# EasyEDA Pro project ProProject_Quantum Mega_v0.2_2024-08-26.epro, board TopPCB
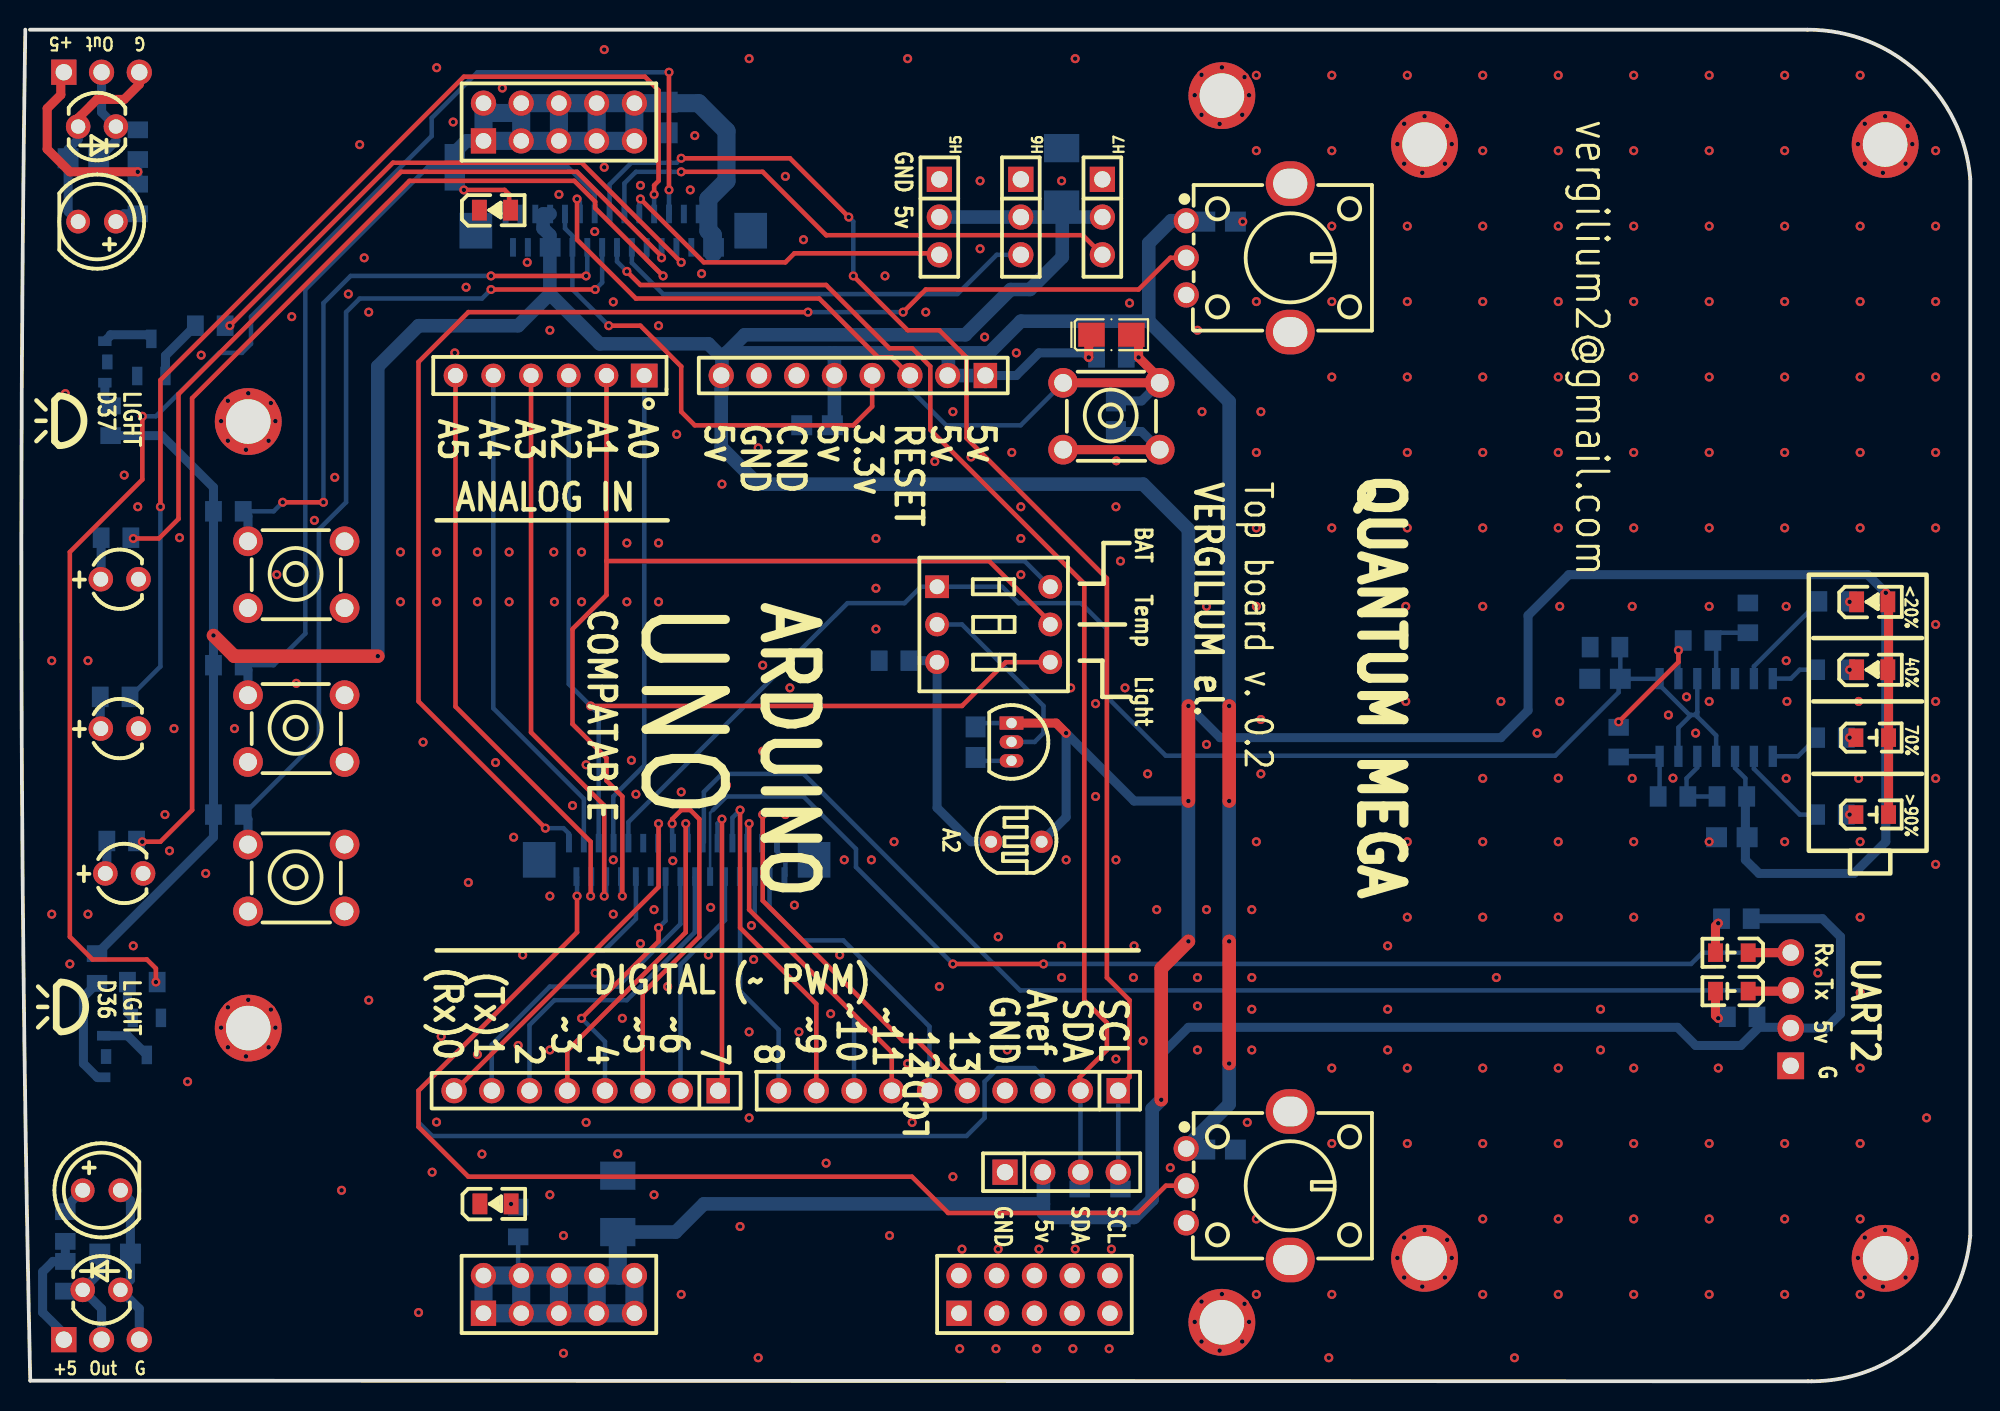
[diagram p5: board, top side]
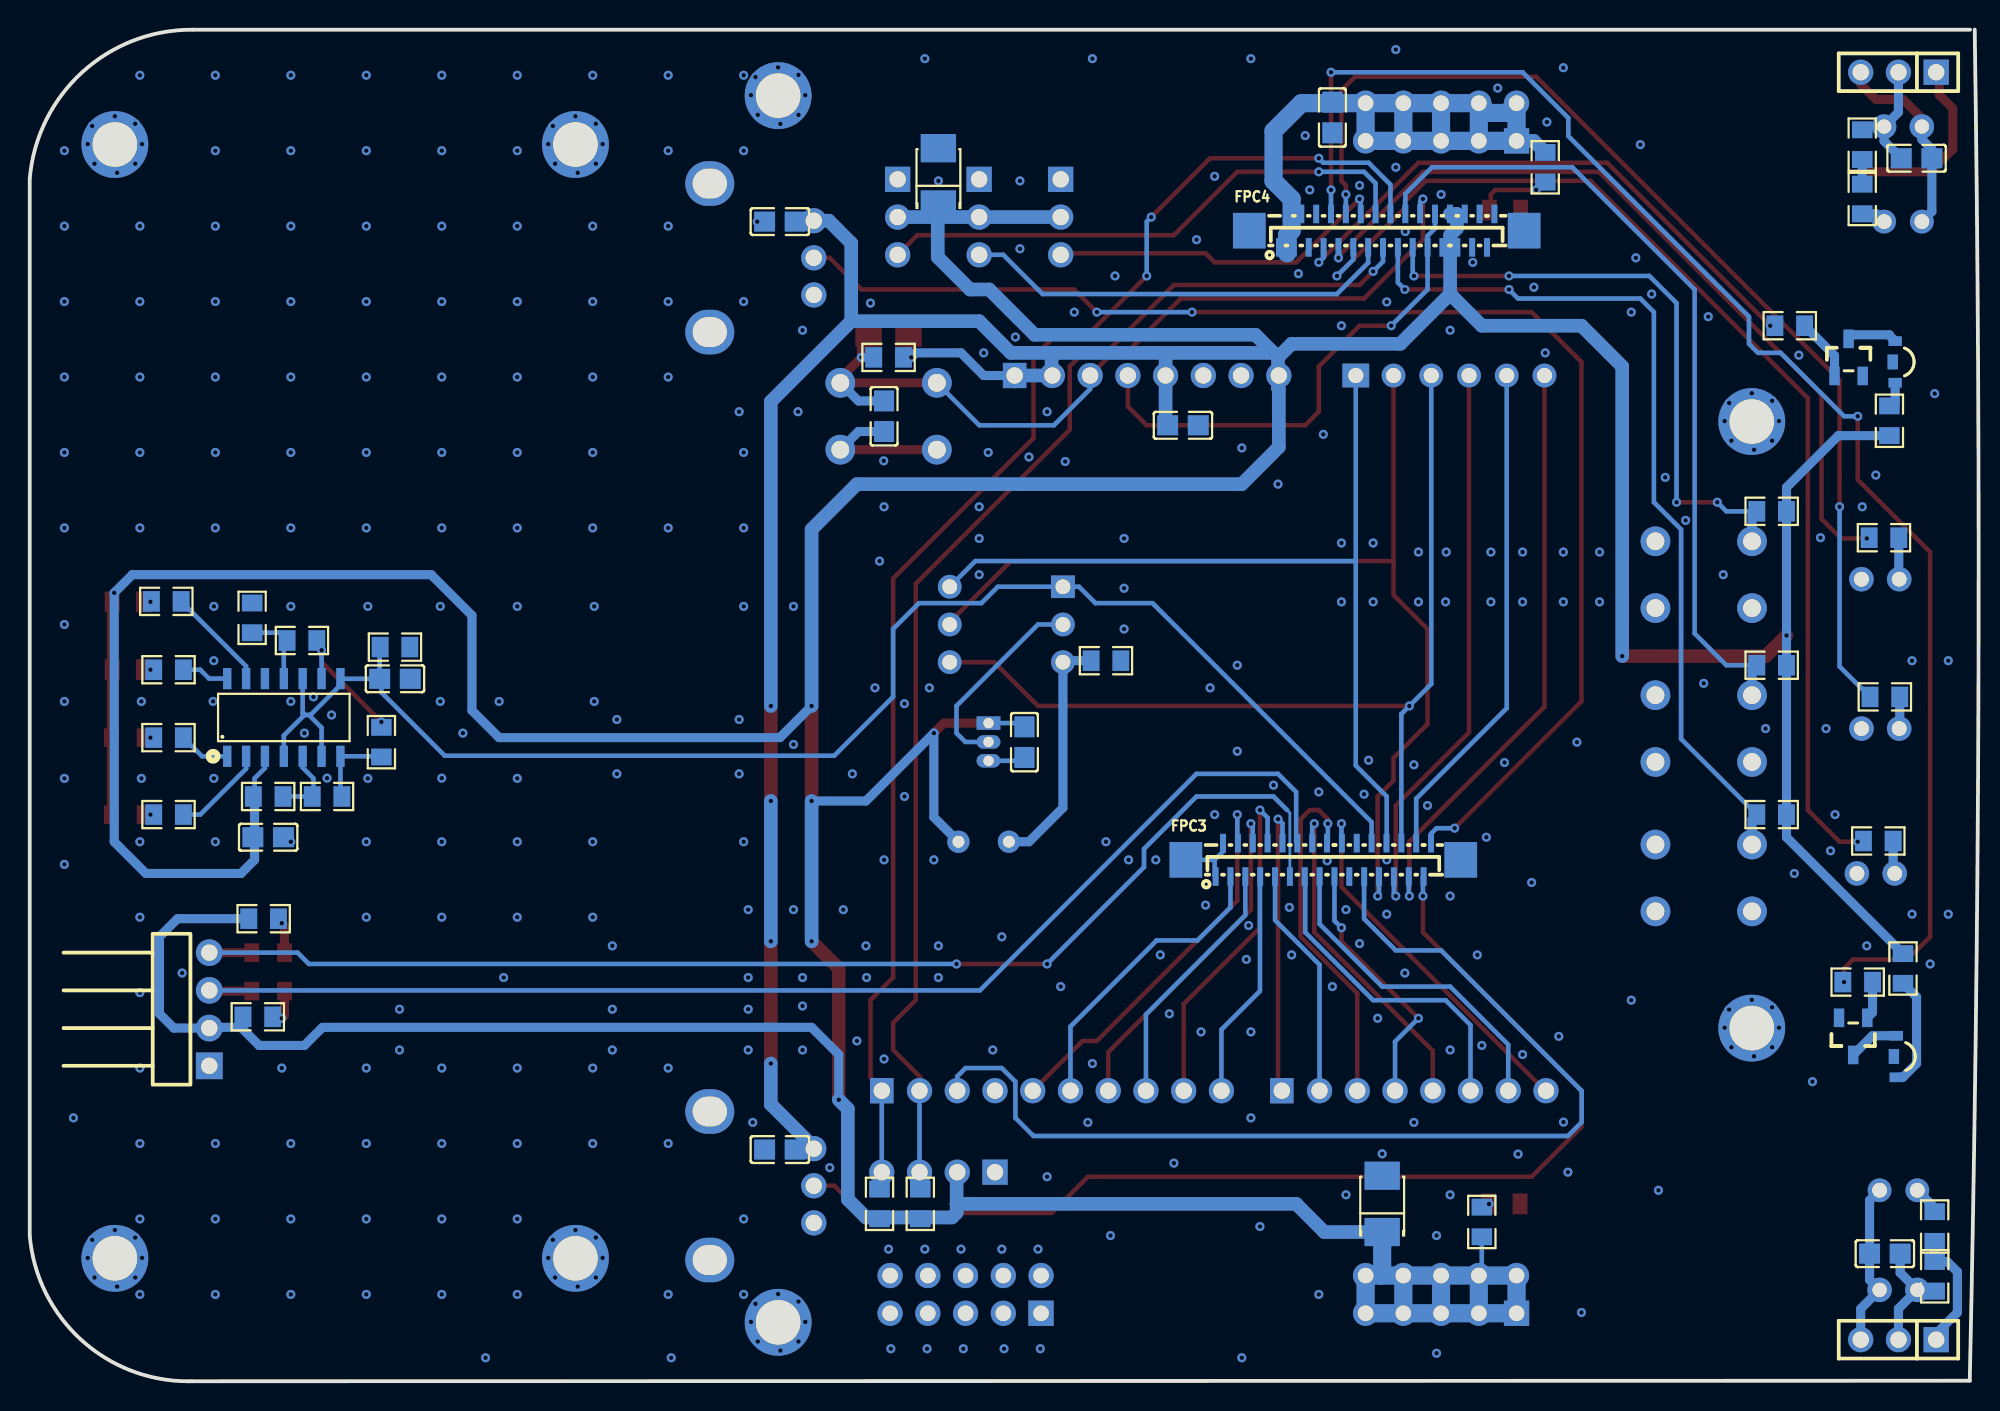
[diagram p6: board, bottom side, seen from below]

Outline 130.61 x 91.01 mm; copper layers: Top Layer, Bottom Layer. Coordinates in mm from the lower left corner of the outline.
Outline path: 0.02,91.01 119.66,91.01 arc(127.1,88.13) 130.61,80.97 130.61,9.8 arc(127.18,2.82) 119.93,0 arc(119.81,0) 119.7,0 0.04,0.04 arc(0,45.53) 0.02,91.01
Stack: Top Layer 0.035mm / Dielectric1 1.51mm FR4 er 4.5 / Bottom Layer 0.035mm

## Design rules (mm)
template: JLCPCB Capability(Single Layer Board)
spacing copperThickness1oz (default): track to track 0.102, other pairs 0.152 to 0.3
spacing copperThickness2oz: track to track 0.203, other pairs 0.152 to 0.3
track width copperThickness1oz (default): min 0.102, default 0.254, max 2.54
track width copperThickness2oz: min 0.203, default 0.254, max 2.54
differential pair differentialPair (default): width min 0.127, default 0.254, max 2.54; gap min 0.152, default 0.152
via viaSize (default): diameter min 0.5, default 1, max 10; hole min 0.3, default 0.5, max 6.3

## Placement (name value [footprint] x y rotation side)
C36  0.1u  [C0805]  52.99 64.37 0 bottom
C37  0.1u  [C0805]  42.94 85.1 90 bottom
C38  10uF  [CAP-SMD_L3.5-W2.8-R-RD]  39.58 11.95 270 bottom
C39  22p  [C0805]  73.11 64.98 270 bottom
C40  0.1u  [C0805]  106.03 47.3 0 bottom
C41  0.1u  [C0805]  63.66 43.04 90 bottom
C42  0.1u  [C0805]  80.12 15.61 180 bottom
C43  0.1u  [C0805]  80.12 78.09 180 bottom
C44  10uF  [CAP-SMD_L3.5-W2.8-R-RD]  69.45 81.14 270 bottom
C45  0.1u  [C0805]  5.75 8.59 0 bottom
C46  0.1u  [C0805]  3.62 82.36 180 bottom
C47  0.1u  [C0805]  114.56 36.64 0 bottom
D6  CD1206  [D1206-RD]  72.81 70.47 0 top
D7  SFH4545  [LED-TH_BD5.0-P2.54-FD]  4.84 12.86 0 top
D8  SFH4545  [LED-TH_BD5.0-P2.54-FD]  4.53 78.09 180 top
FPC3  FFC05012-30SSA124W5M  [FPC-SMD_FFC05012-30SSA124W5M]  43.55 35.11 180 bottom
FPC4  FFC05012-30SSA124W5M  [FPC-SMD_FFC05012-30SSA124W5M]  39.28 77.48 180 bottom
H4  UART2  [HDR-TH_4P-P2.54-H-M-W10.3]  118.53 25.05 90 bottom
H5  D32  [HDR-TH_3P-P2.54-V-M]  61.22 78.39 270 top
H6  D31  [HDR-TH_3P-P2.54-V-M]  66.71 78.39 270 top
H7  D30  [HDR-TH_3P-P2.54-V-M]  72.2 78.39 270 top
KEY1  RESET  [KEY-TH_4P-L6.0-W6.0-P4.50-LS7.5]  72.81 64.98 0 top
KEY2  D41  [KEY-TH_4P-L6.0-W6.0-P4.50-LS7.5]  17.94 54.31 0 top
KEY3  D40  [KEY-TH_4P-L6.0-W6.0-P4.50-LS7.5]  17.94 43.95 0 top
KEY4  D39  [KEY-TH_4P-L6.0-W6.0-P4.50-LS7.5]  17.94 33.89 0 top
LCD1  LCD1602+I2C  [HDR-TH_4P-P2.54-V-F]  69.45 14.08 0 top
LDR1  -  [PHOTO_RESISTOR]  66.41 36.33 270 top
LED10  D35  [LED-TH_BD4.0-P2.54-FD_RED]  6.06 54.01 0 top
LED11  D34  [LED-TH_BD4.0-P2.54-FD_RED]  6.06 43.95 0 top
LED12  D33  [LED-TH_BD4.0-P2.54-FD_RED]  6.36 34.2 0 top
LED13  LED-1204-WHITE  [LED-SMD_3P-L3.20-W1.50-WHITE-SIDE-R-RD]  5.06 21.87 270 bottom
LED14  LED-1204-WHITE  [LED-SMD_3P-L3.20-W1.50-WHITE-SIDE-R-RD]  5.14 68.64 270 bottom
LED15  Green  [LED0805-RD_RED]  124.01 38.16 0 top
LED16  Green  [LED0805-RD_YELLOW]  124.01 43.34 0 top
LED17  Yellow  [LED0805-R-RD_GREEN]  124.01 47.91 0 top
LED18  Red  [LED0805-R-RD_GREEN]  124.01 52.49 0 top
LED19  12v  [LED0805-R-RD_GREEN]  31.32 78.86 0 top
LED20  5v  [LED0805-R-RD_GREEN]  31.35 11.95 0 top
LED21  Rx  [LED0805-RD_RED]  114.56 28.86 180 top
LED22  Tx  [LED0805-RD_RED]  114.56 26.27 180 top
NOREF  -  [Pad_e130]  93.88 8.28 0 top
NOREF#2  -  [Pad_e106]  93.88 83.28 0 top
NOREF#3  -  [Pad_e64]  80.24 86.57 0 top
NOREF#4  -  [Pad_e67]  14.71 64.63 0 top
NOREF#5  -  [Pad_e166]  124.88 8.28 0 top
NOREF#6  -  [Pad_e187]  124.88 83.28 0 top
NOREF#7  -  [Pad_e66]  14.71 23.78 0 top
NOREF#8  -  [Pad_e65]  80.24 3.97 0 top
Q6  BC817  [SOT-23(SOT-23-3)]  7.88 23.23 0 bottom
Q7  BC817  [SOT-23(SOT-23-3)]  8.19 68.95 180 bottom
Q8  TEFT4300  [SENSOR-TH_TEFT4300]  4.84 6.16 90 top
Q9  TEFT4300  [SENSOR-TH_TEFT4300]  4.53 84.49 270 top
R37  10k  [R0805]  70.67 11.95 90 bottom
R38  10k  [R0805]  73.42 11.95 90 bottom
R39  1k  [R0805]  5.81 56.8 180 bottom
R40  470  [R0805]  5.75 46.09 180 bottom
R41  470  [R0805]  6.19 36.38 180 bottom
R42  10k  [R0805]  72.81 68.95 0 bottom
R43  10k  [R0805]  13.37 58.58 0 bottom
R44  10k  [R0805]  13.37 48.22 0 bottom
R45  10k  [R0805]  13.37 38.16 0 bottom
R46  A6  [RES-TH_RK09K1130AAU]  81.34 75.65 270 top
R47  A7  [RES-TH_RK09K1130AAU]  81.34 13.17 270 top
R48  1k  [R0805]  7.58 26.88 180 bottom
R49  220  [R0805]  4.53 27.8 90 bottom
R50  1k  [R0805]  12.15 71.08 180 bottom
R51  220  [R0805]  5.45 64.68 270 bottom
R53  10k  [R0805]  106.03 49.44 0 bottom
R54  5.1k  [R0805]  114.56 39.38 180 bottom
R55  1k  [R0805]  110.6 39.38 0 bottom
R56  1k  [R0805]  106.94 43.04 270 bottom
R57  1k  [R0805]  112.29 49.88 180 bottom
R58  20k  [R0805]  115.64 51.41 270 bottom
R59  470  [R0805]  121.27 38.16 180 bottom
R60  470  [R0805]  121.27 43.34 180 bottom
R61  470  [R0805]  121.27 47.91 180 bottom
R62  1k  [R0805]  121.42 52.52 180 bottom
R63  1k  [R0805]  32.88 10.73 270 bottom
R64  10k  [R0805]  28.61 81.75 90 bottom
R65  1k  [R0805]  114.87 31.15 180 bottom
R66  1k  [R0805]  115.26 24.54 180 bottom
R67  100  [R0805]  2.4 10.42 90 bottom
R68  10k  [R0805]  2.4 7.07 270 bottom
R69  100  [R0805]  7.27 79.61 270 bottom
R70  10k  [R0805]  7.27 83.27 90 bottom
R72  10k  [R0805]  58.18 48.52 0 bottom
SW2  KF1001-03P-B0-GL-DFT-01B  [SW-TH_6P-L9.9-W9.0-P2.54-LS7.6_BLUE]  64.88 50.96 270 top
U13  LM339  [SOP-14_L8.7-W3.9-P1.27-LS6.0-BL]  113.51 44.7 180 bottom
U14  A1  [TO-92-3_L4.9-W3.7-P1.27-L]  66.08 43.05 270 top
XP5  PM2.54-1*8  [HDR-TH_8P-P2.54-V-F]  55.43 67.73 180 top
XP6  PM2.54-1*6  [HDR-TH_6P-P2.54-V-F]  35.01 67.73 180 top
XP7  PM2.54-1*10  [HDR-TH_10P-P2.54-V-F]  61.83 19.57 180 top
XP8  PM2.54-1*8  [HDR-TH_8P-P2.54-V-F]  37.45 19.57 180 top
XP9  +5v  [HDR-TH_10P-P2.54-V-F-R2-C5-S2.54-4]  35.62 5.85 0 top
XP10  GND  [HDR-TH_10P-P2.54-V-F-R2-C5-S2.54-4]  67.62 5.85 0 top
XP11  +12v  [HDR-TH_10P-P2.54-V-F-R2-C5-S2.54-4]  35.62 84.79 0 top
XP12  D32  [HDR-TH_3P-P2.54-V-M]  4.84 2.8 0 bottom
XP13  D32  [HDR-TH_3P-P2.54-V-M]  4.84 88.15 0 bottom

## Footprints (pads in the part's own frame, mm; a bottom-side part is the same pattern mirrored in y, then rotated)
C0805
  rect 1.41x1.35 smd: 1(-1.03,0) 2(1.03,0)
CAP-SMD_L3.5-W2.8-R-RD
  rect 1.9x2.376 smd: 1(1.899,0) 2(-1.899,0)
D1206-RD
  rect 1.785x1.62 smd: 1(-1.343,0) 2(1.343,0)
FPC-SMD_FFC05012-30SSA124W5M
  rect 0.4x1.25 smd: 1(-7.25,-1.125) 2(-6.75,1.125) 3(-6.25,-1.125) 4(-5.75,1.125) 5(-5.25,-1.125) 6(-4.75,1.125) 7(-4.25,-1.125) 8(-3.75,1.125) 9(-3.25,-1.125) 10(-2.75,1.125) 11(-2.25,-1.125) 12(-1.75,1.125) 13(-1.25,-1.125) 14(-0.75,1.125) 15(-0.25,-1.125) 16(0.25,1.125) 17(0.75,-1.125) 18(1.25,1.125) 19(1.75,-1.125) 20(2.25,1.125) 21(2.75,-1.125) 22(3.25,1.125) 23(3.75,-1.125) 24(4.25,1.125) 25(4.75,-1.125) 26(5.25,1.125) 27(5.75,-1.125) 28(6.25,1.125) 29(6.75,-1.125) 30(7.25,1.125)
  rect 2.2x2.4 smd: 31(9.25,0) 32(-9.25,0)
HDR-TH_3P-P2.54-V-M
  rect 1.7x1.7 hole 1.1: 1(-2.54,0)
  round 1.7 hole 1.1: 2(0,0) 3(2.54,0)
HDR-TH_4P-P2.54-H-M-W10.3
  rect 1.8x1.8 hole 1.1: 1(-3.81,0)
  round 1.8 hole 1.1: 2(-1.27,0) 3(1.27,0) 4(3.81,0)
HDR-TH_4P-P2.54-V-F
  rect 1.7x1.7 hole 1.1: 1(-3.81,0)
  round 1.7 hole 1.1: 2(-1.27,0) 3(1.27,0) 4(3.81,0)
HDR-TH_6P-P2.54-V-F
  rect 1.8x1.6 hole 1.02: 1(-6.35,0)
  round 1.6 hole 1.02: 2(-3.81,0) 3(-1.27,0) 4(1.27,0) 5(3.81,0) 6(6.35,0)
HDR-TH_8P-P2.54-V-F
  rect 1.575x1.7 hole 1.1: 1(-8.89,0)
  round 1.7 hole 1.1: 2(-6.35,0) 3(-3.81,0) 4(-1.27,0) 5(1.27,0) 6(3.81,0) 7(6.35,0) 8(8.89,0)
HDR-TH_10P-P2.54-V-F
  rect 1.575x1.7 hole 1.1: 1(-11.43,0)
  round 1.7 hole 1.1: 2(-8.89,0) 3(-6.35,0) 4(-3.81,0) 5(-1.27,0) 6(1.27,0) 7(3.81,0) 8(6.35,0) 9(8.89,0) 10(11.43,0)
HDR-TH_10P-P2.54-V-F-R2-C5-S2.54-4
  rect 1.7x1.7 hole 1.05: 1(-5.08,-1.27)
  round 1.7 hole 1.05: 2(-5.08,1.27) 3(-2.54,-1.27) 4(-2.54,1.27) 5(0,-1.27) 6(0,1.27) 7(2.54,-1.27) 8(2.54,1.27) 9(5.08,-1.27) 10(5.08,1.27)
KEY-TH_4P-L6.0-W6.0-P4.50-LS7.5
  round 2 hole 1.2: 1(-3.25,-2.25) 2(3.25,-2.25) 3(3.25,2.25) 4(-3.25,2.25)
LED0805-R-RD_GREEN
  rect 1x1.399 smd: 1(1.05,0) 2(-1.05,0)
LED0805-RD_RED
  rect 1x1.25 smd: 1(-1.1,0) 2(1.1,0)
LED0805-RD_YELLOW
  rect 1x1.25 smd: 1(-1.1,0) 2(1.1,0)
LED-SMD_3P-L3.20-W1.50-WHITE-SIDE-R-RD
  rect 0.65x0.9 smd: 1(1.4,0.082) 2(-1.4,0.082)
  rect 1x0.7 smd: 3(0,-0.082)
LED-TH_BD4.0-P2.54-FD_RED
  round 1.651 hole 1: 1(-1.27,0) 2(1.27,0)
LED-TH_BD5.0-P2.54-FD
  round 1.6 hole 1: 1(-1.27,0) 2(1.27,0)
Pad_e64
  round 4.5 hole 3: 101(0,0)
Pad_e65
  round 4.5 hole 3: 101(0,0)
Pad_e66
  round 4.5 hole 3: 101(0,0)
Pad_e67
  round 4.5 hole 3: 101(0,0)
Pad_e106
  round 4.5 hole 3: 101(0,0)
Pad_e130
  round 4.5 hole 3: 101(0,0)
Pad_e166
  round 4.5 hole 3: 101(0,0)
Pad_e187
  round 4.5 hole 3: 101(0,0)
PHOTO_RESISTOR
  round 1.5 hole 0.8: 1(0,1.7) 2(0,-1.7)
R0805
  rect 1.133x1.377 smd: 1(-1,0) 2(1,0)
RES-TH_RK09K1130AAU
  round 1.7 hole 1.1: 1(-2.5,-3.5) 2(0,-3.5) 3(2.5,-3.5)
  oval 3x3.3 hole 2x2.3: 4(5,3.5) 5(-5,3.5)
SENSOR-TH_TEFT4300
  round 1.651 hole 0.965: 1(0,1.27) 2(0,-1.27)
SOP-14_L8.7-W3.9-P1.27-LS6.0-BL
  rect 0.56x1.43 smd: 1(-3.81,-2.615) 2(-2.54,-2.615) 3(-1.27,-2.615) 4(0,-2.615) 5(1.27,-2.615) 6(2.54,-2.615) 7(3.81,-2.615) 8(3.81,2.615) 9(2.54,2.615) 10(1.27,2.615) 11(0,2.615) 12(-1.27,2.615) 13(-2.54,2.615) 14(-3.81,2.615)
SOT-23(SOT-23-3)
  rect 0.7x1.25 smd: 1(-0.95,-1.25) 2(0.95,-1.25) 3(0,1.25)
SW-TH_6P-L9.9-W9.0-P2.54-LS7.6_BLUE
  rect 1.524x1.6 hole 1: 1(-2.54,-3.809)
  round 1.6 hole 1: 2(0,-3.81) 3(2.54,-3.81) 4(2.54,3.81) 5(0,3.81) 6(-2.54,3.81)
TO-92-3_L4.9-W3.7-P1.27-L
  rect 0.9x1.6 hole 0.7: 1(-1.27,0)
  oval 0.9x1.6 hole 0.7: 2(0,0) 3(1.27,0)

## Nets
As in the schematic, except:
+3.3V: FPC4.21 FPC4.22 XP5.4
+12V: C37.2 FPC4.1 FPC4.2 FPC4.3 FPC4.4 R64.2 XP11.1 XP11.2 XP11.3 XP11.4 XP11.5 XP11.6 XP11.7 XP11.8 XP11.9 XP11.10
GND: C36.1 C37.1 C38.2 C39.2 C40.1 C41.1 C42.1 C43.1 C44.2 C47.1 FPC3.1 FPC3.2 FPC3.19 FPC3.20 FPC3.31 FPC3.32 FPC4.5 FPC4.6 FPC4.27 FPC4.28 FPC4.29 FPC4.30 FPC4.31 FPC4.32 H4.1 H5.1 H6.1 H7.1 KEY1.1 KEY1.2 KEY2.1 KEY2.2 KEY3.1 KEY3.2 KEY4.1 KEY4.2 LCD1.1 LED10.2 LED11.2 LED12.2 LED19.2 LED20.2 NOREF.101 NOREF#2.101 NOREF#3.101 NOREF#4.101 NOREF#5.101 NOREF#6.101 NOREF#7.101 NOREF#8.101 Q6.2 Q7.2 R46.3 R46.4 R46.5 R47.3 R47.4 R47.5 R53.1 R58.1 R72.1 U13.12 U14.3 XP5.6 XP5.7 XP7.4 XP10.1 XP10.2 XP10.3 XP10.4 XP10.5 XP10.6 XP10.7 XP10.8 XP10.9 XP10.10
AREF: FPC3.21 XP7.3

Pads without a net: KEY2 3; KEY3 3; KEY4 3; LED13 3; LED14 3

## Via types
v1: diameter 0.61, hole 0.305, Top Layer to Bottom Layer, 476 vias

## Routing (per net, layer and track width the routed paths; a pad name or vN(x,y) marks a point on that pad's centre or on a via; arc(x,y) is an arc through that point)
+3.3V: length 33.6
  Top Layer w0.305: XP5.4 56.7,65.64 55.43,64.37 44.76,64.37 43.85,65.29 43.85,68.34 41.11,71.08 v1(38.97,71.08)
  Bottom Layer w0.305: 36.03,78.6 36.03,77.63 36.53,77.13 36.53,73.52 v1(38.97,71.08)
+5V: length 620.7
  Top Layer w0.61: U14.1 69.08,44.32 v1(69.75,43.65) ; v1(71.28,68.95) 71.28,70.29 D6.1 ; LED18.1 125.11,52.44 LED16.2 LED15.2
  Top Layer w0.914: v1(77.98,29.63) 76.16,27.8 v1(76.16,18.96) ; v1(80.73,29.63) v1(80.73,21.4) ; v1(77.98,45.48) v1(77.98,39.07) ; v1(80.73,45.48) v1(80.73,39.07) ; v1(23.43,48.83) 13.76,48.83 v1(12.37,50.22)
  Bottom Layer w0.305: XP9.4 32.87,7.32 R63.2 ; U14.1 63.91,44.32 C41.2 ; R54.1 115.47,39.47 115.47,40.6 114.78,41.3 U13.3
  Bottom Layer w0.61: 64.32,67.17 64.88,67.73 66.4,67.73 67.93,69.25 70.97,69.25 v1(71.28,68.95) ; R51.2 8.88,63.68 12.37,60.19 R43.1 v1(12.37,50.22) R44.1 R45.1 12.37,36.64 R49.2 ; R65.1 120.66,31.15 121.88,29.93 121.88,24.75 120.91,23.78 H4.2 118.47,23.83 116.39,23.83 115.17,22.62 112.12,22.62 110.9,23.83 77.98,23.83 76.16,22.01 v1(76.16,18.96) ; R54.1 115.47,39.29 115.47,35.11 116.39,34.2 122.79,34.2 124.92,36.33 v1(124.92,53.09) 123.7,54.31 103.59,54.31 100.84,51.57 100.84,45.17 99.02,43.34 80.12,43.34 v1(77.98,45.48) ; LDR1.1 69.75,37.98 v1(69.75,43.65) 74.33,39.07 v1(77.98,39.07)
  Bottom Layer w0.914: 69.5,78.39 H6.2 H5.2 ; 69.5,78.39 69.5,75.7 67.32,73.52 66.02,73.52 62.98,70.47 48.11,70.47 46.89,69.25 ; 69.5,78.39 H7.2 ; 54.16,68.95 53.85,69.25 46.89,69.25 ; 54.16,68.95 54.16,69.25 61.53,69.25 61.83,68.95 ; 54.16,68.95 XP5.5 54.16,64.51 C36.2 ; v1(80.73,21.4) 80.73,18.65 77.84,15.76 R47.1 ; 64.32,67.37 63.96,67.73 XP5.2 61.83,67.78 61.83,68.95 ; 75.32,71.38 80.73,65.97 v1(80.73,45.48) ; 75.32,71.38 66.71,71.38 64.57,69.25 61.83,69.25 61.83,68.95 ; 75.32,71.38 75.32,76.64 76.83,78.15 78.45,78.15 ; v1(77.98,29.63) v1(77.98,39.07) ; LCD1.2 68.22,14.04 68.22,11.95 ; FPC4.24 34.55,78.6 34.55,77.63 35.01,77.17 35.01,73.21 ; 46.89,69.25 46.59,68.95 ; 35.01,73.21 32.87,71.08 26.17,71.08 23.43,68.34 v1(23.43,48.83) ; 35.01,73.21 38.36,69.86 45.68,69.86 46.59,68.95 ; v1(76.16,18.96) 75.55,18.35 75.55,12.25 74.33,11.03 68.54,11.03 68.22,11.34 68.22,11.95 ; 68.22,11.95 45.37,11.95 43.47,10.05 C38.1 ; 46.59,68.95 46.59,66.86 46.54,66.81 46.54,62.9 49.03,60.41 74.94,60.41 77.98,57.36 v1(77.98,45.48) ; v1(80.73,29.63) v1(80.73,39.07)
  Bottom Layer w1.219: XP9.3 XP9.1 XP9.2 XP9.4 ; XP9.3 XP9.5 ; XP9.3 XP9.4 ; 39.65,7.12 XP9.10 XP9.9 XP9.7 ; 39.65,7.12 XP9.8 ; 39.65,7.12 39.58,7.19 C38.1 ; XP9.6 XP9.5 ; XP9.6 XP9.8 ; XP9.6 XP9.4 ; XP9.5 XP9.7 ; XP9.7 XP9.8
+12V: length 51.7
  Bottom Layer w0.914: XP11.1 29.38,83.52 R64.2
  Bottom Layer w1.219: XP11.8 XP11.7 ; XP11.8 XP11.10 ; XP11.8 XP11.6 ; XP11.7 XP11.5 ; XP11.7 XP11.9 XP11.10 ; 45.98,75.95 45.98,77.17 45.68,77.48 45.68,79.61 46.89,80.83 46.89,84.19 45.02,86.06 XP11.10 ; XP11.5 XP11.3 ; XP11.5 XP11.6 ; XP11.4 32.42,85.4 31.2,85.4 XP11.2 XP11.1 XP11.3 ; XP11.4 XP11.6 ; XP11.4 XP11.3
GND: length 16.9
  Top Layer w0.61: KEY1.2 69.56,62.73
  Bottom Layer w0.305: C41.1 63.88,41.78 U14.3 ; FPC3.32 50.86,35.11 ; 50.86,35.11 50.86,34.05 FPC3.1 ; 50.86,35.11 50.29,35.68 FPC3.2
  Bottom Layer w0.61: KEY1.2 74.83,63.95 C39.2
  vias: v1(1.48,48.52) v1(1.48,31.45) v1(2.4,66.51) v1(2.7,28.1) v1(3.92,48.52) v1(3.92,31.45) v1(6.36,61.02) v1(6.97,29.32) v1(7.27,58.89) v1(9.1,38.16) v1(9.41,35.72) v1(9.71,43.95) v1(10.08,56.8) v1(10.63,20.18) v1(11.54,69.1) v1(11.85,34.2) v1(12.88,64.65) v1(12.88,23.81) v1(13.34,66.03) v1(13.34,63.33) v1(13.34,25.18) v1(13.34,22.49) v1(13.78,43.95) v1(14.56,62.72) v1(14.56,21.88) v1(14.71,66.53) v1(14.71,25.69) v1(16.08,63.33) v1(16.08,22.49) v1(16.23,65.87) v1(16.23,25.03) v1(16.54,64.65) v1(16.54,23.81) v1(16.63,54.31) v1(17.64,71.69) v1(17.94,47) v1(19.16,57.97) v1(20.53,60.87) v1(20.99,12.86) v1(21.45,73.21) v1(22.21,83.27) v1(22.51,75.65) v1(22.82,71.99) v1(22.82,25.66) v1(24.95,55.84) v1(24.95,52.49) v1(26.17,4.63) v1(26.48,43.04) v1(27.09,14.08) v1(27.39,88.45) v1(27.39,55.84) v1(27.39,52.49) v1(27.38,17.45) v1(27.7,23.23) v1(28.5,84.79) v1(28.61,69.25) v1(29.37,73.67) v1(29.52,33.59) v1(30.13,55.84) v1(30.13,52.49) v1(30.13,22.01) v1(30.44,15.3) v1(31.35,41.67) v1(31.81,87.08) v1(32.27,55.84) v1(32.27,52.49) v1(32.57,36.64) v1(32.88,22.62) v1(33.18,28.71) v1(33.49,75.35) v1(35.01,70.77) v1(35.01,32.67) v1(35.01,22.31) v1(35.01,12.56) v1(35.28,55.84) v1(35.32,52.49) v1(35.62,79.92) v1(35.93,9.81) v1(35.93,1.89) v1(36.54,38.77) v1(37.14,55.84) v1(37.14,52.49) v1(37.45,41.51) v1(37.45,17.43) v1(38.03,77.42) v1(38.06,27.49) v1(38.67,89.67) v1(38.67,81.75) v1(39.28,72.68) v1(39.28,35.11) v1(39.28,31.45) v1(39.58,15.32) v1(39.89,24.44) v1(40.19,56.45) v1(40.19,52.49) v1(40.5,41.82) v1(40.8,39.53) v1(41.11,80.53) v1(41.11,29.47) v1(42.02,31.76) v1(42.02,12.56) v1(42.33,71.08) v1(42.33,56.45) v1(42.33,52.49) v1(42.94,26.58) v1(43.29,35.05) v1(43.55,63.76) v1(43.85,39.68) v1(43.85,5.85) v1(44.46,80.22) v1(44.76,83.88) v1(45.22,74.58) v1(45.68,28.71) v1(45.83,31.91) v1(46.59,60.41) v1(46.9,40.14) v1(47.81,10.42) v1(48.42,89.06) v1(48.42,23.53) v1(48.42,17.74) v1(48.57,30.69) v1(48.73,28.41) v1(49.03,62.85) v1(49.03,1.58) v1(49.34,48.22) v1(49.34,42.43) v1(50.86,81.14) v1(50.86,38.16) v1(51.17,46.69) v1(51.47,32.06) v1(51.78,23.53) v1(52.08,76.87) v1(53.6,14.69) v1(53.91,24.75) v1(54.52,28.71) v1(54.82,35.11) v1(56.65,35.11) v1(56.96,56.75) v1(56.96,53.4) v1(56.96,50.66) v1(57.57,74.43) v1(57.87,9.81) v1(58.18,36.33) v1(59.09,89.06) v1(59.09,21.4) v1(59.4,17.43) v1(60.31,71.99) v1(60.92,61.93) v1(61.22,26.58) v1(62.14,65.29) v1(62.14,13.78) v1(62.6,2.19) v1(62.75,8.9) v1(63.36,62.24) v1(63.97,80.83) v1(63.97,76.26) v1(64.27,70.32) v1(65.03,2.19) v1(65.19,29.93) v1(65.19,8.9) v1(65.8,22.31) v1(66.1,62.54) v1(66.41,69.25) v1(66.71,58.89) v1(66.71,56.75) v1(66.71,54.31) v1(67.78,2.19) v1(67.93,8.9) v1(69.45,80.83) v1(69.45,29.32) v1(69.45,27.19) v1(69.76,35.11) v1(70.06,46.69) v1(70.22,2.19) v1(70.37,89.06) v1(70.37,8.9) v1(71.74,45.63) v1(71.74,39.38) v1(72.65,2.19) v1(72.81,8.9) v1(73.13,61.98) v1(73.11,58.89) v1(73.11,35.11) v1(73.11,21.7) v1(73.42,55.23) v1(73.72,46.69) v1(74.03,72.6) v1(74.29,27.19) v1(74.33,29.32) v1(74.94,22.92) v1(75.24,40.9) v1(75.85,31.76) v1(76.77,14.39) v1(78.41,86.6) v1(78.41,4) v1(78.6,70.77) v1(78.6,27.19) v1(78.6,25.27) v1(78.6,22.31) v1(78.87,87.97) v1(78.87,85.28) v1(78.9,65.29) v1(78.87,5.37) v1(78.87,2.68) v1(79.21,52.18) v1(79.21,42.88) v1(79.21,31.76) v1(80.09,84.67) v1(80.09,2.07) v1(80.24,88.48) v1(80.24,5.87) v1(81.61,85.28) v1(81.65,78.09) v1(81.61,2.68) v1(81.76,87.82) v1(81.76,5.22) v1(81.95,17.43) v1(82.07,86.6) v1(82.07,4) v1(82.26,31.76) v1(82.26,27.19) v1(82.26,25.05) v1(82.26,22.31) v1(82.56,87.94) v1(82.56,82.86) v1(82.56,72.7) v1(82.56,62.54) v1(82.56,57.46) v1(82.56,52.18) v1(82.56,36.33) v1(82.56,10.93) v1(82.56,5.85) v1(82.86,65.29) v1(82.86,44.56) v1(82.86,40.9) v1(87.44,1.58) v1(87.64,87.94) v1(87.64,82.86) v1(87.64,77.78) v1(87.64,72.7) v1(87.64,67.62) v1(87.64,57.46) v1(87.64,21.09) v1(87.64,16.01) v1(87.64,5.85) v1(91.09,44.56) v1(91.09,40.9) v1(91.4,29.32) v1(91.4,25.05) v1(91.4,22.31) v1(92.05,83.31) v1(92.05,8.31) v1(92.51,84.68) v1(92.51,81.99) v1(92.51,9.68) v1(92.51,6.99) v1(92.62,52.18) v1(92.62,45.78) v1(92.72,87.94) v1(92.72,77.78) v1(92.72,72.7) v1(92.72,67.62) v1(92.72,62.54) v1(92.72,57.46) v1(92.72,36.33) v1(92.72,31.25) v1(92.72,21.09) v1(92.72,16.01) v1(93.73,81.38) v1(93.73,6.38) v1(93.88,85.18) v1(93.88,10.18) v1(95.25,81.99) v1(95.25,6.99) v1(95.41,84.53) v1(95.41,9.53) v1(95.71,83.31) v1(95.71,8.31) v1(97.8,87.94) v1(97.8,82.86) v1(97.8,77.78) v1(97.8,72.7) v1(97.8,67.62) v1(97.8,62.54) v1(97.8,57.46) v1(97.8,52.18) v1(97.8,40.6) v1(97.8,36.33) v1(97.8,31.25) v1(97.8,21.09) v1(97.8,16.01) v1(97.8,10.93) v1(97.8,5.85) v1(98.71,27.19) v1(99.02,45.78) v1(99.93,1.58) v1(101.46,43.65) v1(102.88,87.94) v1(102.88,82.86) v1(102.88,77.78) v1(102.88,72.7) v1(102.88,67.62) v1(102.88,62.54) v1(102.88,57.46) v1(102.88,40.61) v1(102.88,36.33) v1(102.88,31.25) v1(102.88,21.09) v1(102.88,16.01) v1(102.88,10.93) v1(102.88,5.85) v1(102.98,52.18) v1(102.98,45.78) v1(105.72,25.05) v1(105.72,22.31) v1(107.86,52.18) v1(107.86,40.6) v1(107.96,87.94) v1(107.96,82.86) v1(107.96,77.78) v1(107.96,72.7) v1(107.96,67.62) v1(107.96,62.54) v1(107.96,57.46) v1(107.96,36.33) v1(107.96,31.25) v1(107.96,21.09) v1(107.96,16.01) v1(107.96,10.93) v1(107.96,5.85) v1(110.3,44.87) v1(110.6,40.61) v1(111.52,46.09) v1(112.13,43.65) v1(113.04,87.94) v1(113.04,82.86) v1(113.04,77.78) v1(113.04,72.7) v1(113.04,67.62) v1(113.04,62.54) v1(113.04,57.46) v1(113.04,52.18) v1(113.04,45.78) v1(113.04,36.33) v1(113.04,16.01) v1(113.04,10.93) v1(113.04,5.85) v1(113.65,21.09) v1(118.12,87.94) v1(118.12,82.86) v1(118.12,77.78) v1(118.12,72.7) v1(118.12,67.62) v1(118.12,62.54) v1(118.12,57.46) v1(118.12,36.33) v1(118.12,16.01) v1(118.12,10.93) v1(118.12,5.85) v1(118.22,52.18) v1(118.22,48.52) v1(118.27,45.78) v1(118.22,40.6) v1(120.36,27.49) v1(123.05,83.31) v1(123.1,45.78) v1(123.1,40.6) v1(123.05,8.31) v1(123.2,87.94) v1(123.2,77.78) v1(123.2,72.7) v1(123.2,67.62) v1(123.2,62.54) v1(123.2,57.46) v1(123.2,36.33) v1(123.2,31.25) v1(123.2,26.17) v1(123.2,21.09) v1(123.2,16.01) v1(123.2,10.93) v1(123.2,5.85) v1(123.51,84.68) v1(123.51,81.99) v1(123.51,9.68) v1(123.51,6.99) v1(124.73,81.38) v1(124.73,6.38) v1(124.88,85.18) v1(124.88,10.18) v1(126.25,81.99) v1(126.25,6.99) v1(126.41,84.53) v1(126.41,9.53) v1(126.71,83.31) v1(126.71,8.31) v1(127.67,17.74) v1(128.28,82.86) v1(128.28,77.78) v1(128.28,72.7) v1(128.28,67.62) v1(128.28,62.54) v1(128.28,57.46) v1(128.28,50.96) v1(128.28,45.78) v1(128.28,40.6) v1(128.28,34.81)
+BAT: length 102.3
  Bottom Layer w0.305: C40.2 106.94,47.19 106.94,46.39 102.67,42.12 76.46,42.12 72.5,46.09 72.5,50.66 70.76,52.4 66.56,52.4 65.45,53.5 SW2.1 59.98,53.5 58.88,52.4 55.04,52.4 40.29,37.65 FPC3.22 ; C40.2 109.68,47.3 U13.8 109.7,46.88 111.72,44.87 111.82,44.87 ; C40.2 107.06,49.41 R53.2 ; U13.10 112.24,45.06 ; 112.24,45.06 112.24,44.75 113.51,43.48 U13.4 ; 112.24,45.06 112.05,44.87 111.82,44.87 ; 111.82,44.87 110.97,44.01 U13.6
A0: length 60.4
  Bottom Layer w0.305: FPC3.24 39.27,36.25 39.27,39.38 41.36,41.46 41.36,55.23 ; SW2.6 66.96,55.23 41.36,55.23 ; XP6.1 41.36,55.23
A1: length 70.5
  Top Layer w0.305: 38.82,55.23 64.57,55.23 68.69,51.11 SW2.5 ; 38.82,55.23 38.82,52.94 36.53,50.66 36.53,44.26 38.82,41.97 38.82,40.45 39.88,39.38 v1(39.88,32.67) ; 38.82,55.23 XP6.2
  Bottom Layer w0.305: FPC3.23 39.8,32.77 v1(39.89,32.67)
A2: length 64.5
  Top Layer w0.305: SW2.4 65.69,48.42 62.75,45.48 v1(37.75,45.48)
  Bottom Layer w0.305: FPC3.26 38.3,44.93 v1(37.75,45.48) 36.28,46.95 XP6.3
A3: length 38.5
  Top Layer w0.305: v1(38.67,32.67) 38.67,38.77 33.74,43.7 XP6.4
  Bottom Layer w0.305: FPC3.25 38.8,32.8 v1(38.67,32.67)
A4: length 34
  Bottom Layer w0.305: XP6.5 31.2,45.32 37.3,39.23 FPC3.28
A5: length 40.1
  Top Layer w0.305: XP6.6 28.66,45.42 37.75,36.33 v1(37.75,32.67)
  Bottom Layer w0.305: v1(37.75,32.67) 37.79,32.72 FPC3.27
AREF: length 71.3
  Bottom Layer w0.305: FPC3.21 40.8,33.98 40.8,31.15 38.67,29.02 35.62,29.02 26.15,19.55 26.15,17.45 27.09,16.52 63.05,16.52 64.27,17.74 64.27,20.18 65.19,21.09 67.62,21.09 68.18,20.53 XP7.3
BTN0: length 41.6
  Top Layer w0.305: v1(31.05,74.43) v1(37.45,74.43) ; v1(19.77,59.19) v1(17.02,59.19)
  Bottom Layer w0.305: v1(31.05,74.43) 21.6,74.43 19.77,72.6 v1(19.77,59.19) ; FPC4.19 37.53,74.51 v1(37.45,74.43) ; R43.2 16.41,58.58 v1(17.02,59.19)
  Bottom Layer w0.61: 14.69,56.56 14.69,58.26 R43.2
BTN1: length 55.4
  Bottom Layer w0.305: FPC4.18 38.03,79.95 36.23,81.75 26.78,81.75 18.55,73.52 18.55,50.35 16.42,48.22 R44.2
  Bottom Layer w0.61: 14.69,46.2 14.69,47.9 R44.2
BTN2: length 59.3
  Top Layer w0.305: v1(31.05,73.52) v1(38.06,73.52)
  Bottom Layer w0.305: 38.53,76.35 38.53,73.99 v1(38.06,73.52) ; v1(31.05,73.52) 30.44,72.91 22.21,72.91 21.29,71.99 21.29,59.19 19.46,57.36 19.46,43.26 R45.2
  Bottom Layer w0.61: 14.69,36.14 14.69,37.84 R45.2
D0: length 25.1
  Top Layer w0.305: 28.56,19.52 42.33,33.28 v1(42.33,37.55)
  Bottom Layer w0.305: FPC3.18 42.32,36.27 v1(42.32,37.55)
D1: length 22.4
  Bottom Layer w0.305: XP8.7 31.1,22.67 35.01,26.58 39.58,26.58 43.8,30.79 FPC3.15
D2: length 21.9
  Bottom Layer w0.305: FPC3.13 44.76,33.96 44.76,30.24 40.19,25.66 35.32,25.66 33.64,23.99 XP8.6
D3: length 22.7
  Top Layer w0.305: XP8.5 36.18,22.26 44.15,30.23 v1(44.15,37.55)
  Bottom Layer w0.305: v1(44.16,37.55) 44.3,37.41 FPC3.14
D4: length 17.4
  Top Layer w0.305: v1(42.32,30.54) 42.32,29.63 v1(37.14,24.44)
  Bottom Layer w0.305: v1(37.14,24.44) 38.72,22.87 XP8.4 ; FPC3.17 42.79,31.01 v1(42.32,30.54)
D5: length 23.8
  Top Layer w0.305: XP8.3 41.26,26.12 45.07,29.93 45.07,37.86 44.46,38.47 43.85,38.47 43.24,37.86 v1(43.24,37.55)
  Bottom Layer w0.305: FPC3.16 43.24,36.29 v1(43.24,37.55)
D6: length 15.7
  Bottom Layer w0.305: XP8.2 43.8,28.05 46.79,31.05 FPC3.9
D7: length 20.1
  Top Layer w0.305: XP8.1 46.59,19.82 v1(46.59,37.86)
  Bottom Layer w0.305: v1(46.59,37.86) 46.3,37.56 FPC3.10
D8: length 15.5
  Bottom Layer w0.305: XP7.10 50.4,23.68 47.81,26.27 47.81,33.97 FPC3.7
D9: length 23.5
  Top Layer w0.305: v1(47.81,38.47) 47.81,30.54 52.94,25.41 XP7.9
  Bottom Layer w0.305: v1(47.81,38.47) 47.3,37.95 FPC3.8
D10: length 17.2
  Bottom Layer w0.305: XP7.8 55.48,24.7 48.79,31.39 FPC3.5
D11: length 23.3
  Top Layer w0.305: XP7.7 58.02,22.16 48.42,31.76 v1(48.42,37.55)
  Bottom Layer w0.305: v1(48.42,37.55) 48.3,37.42 FPC3.6
D12: length 20.5
  Bottom Layer w0.305: FPC3.3 49.8,31.91 52.02,29.69 54.76,29.69 60.56,23.89 XP7.6
D13: length 26.8
  Top Layer w0.305: XP7.5 59.75,22.92 58.78,22.92 49.33,32.37 v1(49.33,38.16)
  Bottom Layer w0.305: v1(49.34,38.16) 49.34,36.28 FPC3.4
D30: length 36.9
  Top Layer w0.305: H7.3 70.88,77.17 53.6,77.17 49.34,81.44 v1(43.85,81.44)
  Bottom Layer w0.305: v1(43.85,81.44) 40.8,81.44 40.02,80.67 FPC4.14
D31: length 29.2
  Bottom Layer w0.305: 40.53,76.35 40.53,75.31 42.63,73.21 62.44,73.21 65.08,75.85 H6.3
D32: length 23.2
  Top Layer w0.305: H5.3 61.12,75.96 51.47,75.96 50.86,75.35 45.37,75.35 v1(41.11,79.61)
  Bottom Layer w0.305: v1(41.11,79.61) 41.03,79.53 FPC4.12
D33: length 75
  Top Layer w0.305: v1(42.63,74.43) 38.06,79 38.06,79.43 36.66,80.83 25.56,80.83 10.93,66.2 10.93,38.47 8.79,36.33 v1(7.58,36.33)
  Bottom Layer w0.305: v1(42.63,74.43) 41.53,75.53 41.53,76.35
D34: length 73
  Top Layer w0.305: v1(42.02,79.92) 42.02,80.53 42.32,80.83 42.32,86.93 41.41,87.84 29.22,87.84 8.79,67.42 v1(8.79,58.89)
  Bottom Layer w0.305: v1(8.79,58.89) 8.79,48.13 R40.1 ; FPC4.10 v1(42.02,79.92)
D35: length 53.9
  Top Layer w0.305: v1(42.53,75.65) 42.53,75.75 36.84,81.44 24.99,81.44 10.02,66.47 10.02,58.07 8.7,56.75 v1(6.97,56.75)
  Bottom Layer w0.305: 42.53,76.35 v1(42.53,75.65)
D36: length 101
  Top Layer w0.305: v1(43.02,80.22) v1(43.02,88.15) ; v1(8.49,26.88) 8.49,27.8 7.88,28.41 4.22,28.41 2.7,29.93 2.7,55.84 7.58,60.72 v1(7.58,64.98)
  Bottom Layer w0.305: v1(7.58,64.98) 8.49,64.98 12.76,69.25 14.28,69.25 14.89,69.86 14.89,71.69 27.05,83.85 27.05,85.07 30.13,88.15 v1(43.02,88.15) ; FPC4.8 v1(43.02,80.22)
D37: length 38.8
  Top Layer w0.305: v1(13.47,71.08) 24.44,82.05 37.14,82.05 v1(43.85,75.35)
  Bottom Layer w0.305: v1(43.85,75.35) 43.53,75.67 43.53,76.35
POT1: length 91.9
  Top Layer w0.305: v1(34.7,37.25) 26.17,45.78 26.17,68.64 29.52,71.99 v1(52.38,71.99) ; v1(58.78,71.99) 60.31,73.52 74.63,73.52 76.77,75.65 R46.2
  Bottom Layer w0.305: v1(34.7,37.25) 35.92,37.25 36.29,36.88 FPC3.30 ; v1(58.78,71.99) v1(52.38,71.99)
POT2: length 76.1
  Top Layer w0.305: v1(36.84,32.67) 36.84,30.24 26.17,19.57 26.17,17.13 29.52,13.78 59.38,13.78 61.82,11.34 74.64,11.34 76.46,13.17 R47.2
  Bottom Layer w0.305: v1(36.84,32.67) 36.84,33.94 FPC3.29
RESET: length 58.2
  Top Layer w0.305: XP5.3 58.02,68.95 57.11,68.95 53.15,72.91 40.8,72.91 36.84,76.87 v1(36.84,79.61)
  Top Layer w0.61: 69.55,67.23 KEY1.3 76.05,67.52 v1(74.63,68.95) 74.63,69.98 D6.2
  Bottom Layer w0.305: 69.56,67.23 66.7,64.37 61.68,64.37 59.24,66.81 XP5.3 ; 37.03,78.6 37.03,79.42 v1(36.84,79.61)
  Bottom Layer w0.61: KEY1.3 74.83,66.01 C39.1 ; v1(74.63,68.95) R42.2
RX2: length 86
  Top Layer w0.305: v1(62.14,28.1) v1(68.23,28.1)
  Top Layer w0.61: LED21.1 H4.4
  Bottom Layer w0.178: 45.98,38.47 45.8,38.28 FPC3.11
  Bottom Layer w0.305: H4.4 112.58,28.86 111.82,28.1 v1(68.23,28.1) ; 45.98,38.47 46.89,39.38 52.08,39.38 55.61,35.84 55.61,34.62 v1(62.13,28.1)
SCL: length 93.1
  Top Layer w0.305: v1(55.43,74.43) 59.09,70.77 61.22,70.77 63.05,68.95 63.05,63.51 72.5,54.06 72.5,27.19 74.02,25.66 74.02,20.48 73.26,19.72 ; v1(43.85,82.36) 51.16,82.36 v1(55.12,78.39)
  Bottom Layer w0.305: v1(43.85,82.36) 43.54,82.05 40.49,82.05 39.02,80.58 FPC4.16 ; v1(55.12,78.39) 55.43,78.09 v1(55.43,74.43) ; LCD1.4 73.26,18.65
SDA: length 84
  Top Layer w0.305: v1(40.19,74.74) 41.11,73.82 53.6,73.82 57.87,69.55 59.4,69.55 60.61,68.34 60.61,64.07 70.98,53.71 70.98,25.66 72.5,24.14 72.5,22.31 70.67,20.48 70.67,19.62 XP7.2
  Bottom Layer w0.305: 39.53,76.35 39.53,75.4 v1(40.19,74.74) ; LCD1.3 70.72,18.65
TX2: length 86.1
  Top Layer w0.61: H4.3 118.47,26.27 LED22.1
  Bottom Layer w0.305: H4.3 66.66,26.32 52.08,40.9 46.59,40.9 45.37,39.68 45.37,36.32 FPC3.12
$1N2925: length 2.8
  Bottom Layer w0.61: LED10.1 4.81,54.04 R39.2
$1N2926: length 2.1
  Bottom Layer w0.61: LED11.1 4.75,43.99 R40.2
$1N2927: length 2.2
  Bottom Layer w0.61: R41.2 5.19,34.3 LED12.1
$1N3000: length 3.4
  Bottom Layer w0.61: 7.88,21.98 6.59,23.27 LED13.2
$1N3001: length 7.5
  Bottom Layer w0.61: LED13.1 4.54,20.47 3.62,21.4 3.62,25.88 R49.1
$1N3003: length 2.6
  Bottom Layer w0.61: R48.2 6.58,24.83 Q6.1
$1N3005: length 3.4
  Bottom Layer w0.61: LED14.2 5.44,70.43 5.44,70.47 7.91,70.47 Q7.3
$1N3007: length 4.2
  Bottom Layer w0.61: R50.2 9.14,69.07 Q7.1
$1N3009: length 1.8
  Bottom Layer w0.61: 5.36,65.59 5.06,65.89 LED14.1
$1N8006: length 5.5
  Bottom Layer w0.305: R56.2 106.99,42.09 U13.7 109.7,39.48 R55.1
$1N8015: length 9.2
  Top Layer w0.305: v1(110.97,49.23) 110.97,48.43 v1(106.94,44.4)
  Bottom Layer w0.305: U13.9 v1(110.97,49.23) 110.97,49.56 R57.2
$1N8024: length 5.2
  Bottom Layer w0.305: R58.2 113.81,50.41 R57.1 113.51,49.66 U13.11
$1N8311: length 6
  Bottom Layer w0.305: 119.96,38.16 119.14,38.16 116.05,41.25 U13.2
$1N8350: length 3.5
  Bottom Layer w0.305: R60.2 119.01,42.09 U13.1
$1N8389: length 3.2
  Bottom Layer w0.305: U13.14 118.53,47.32 119.13,47.91 R61.2
$1N8428: length 7
  Bottom Layer w0.305: U13.13 116.05,48.15 R62.2
$1N8588:
  vias: v1(122.49,38.16)
$1N8590:
  vias: v1(122.49,43.34)
$1N8592:
  vias: v1(122.49,47.91)
$1N8594:
  vias: v1(122.49,52.49)
$1N8734: length 5
  Bottom Layer w0.305: U13.5 112.24,41.32 111.52,40.6 111.52,39.47 R55.2 R54.2
$1N8989: length 4.3
  Top Layer w0.305: v1(29.22,80.22) 31.96,80.22 32.26,79.92 32.26,78.96 LED19.1
$1N9069:
  vias: v1(32.39,11.94)
$1N18209: length 2.1
  Top Layer w0.61: v1(113.65,30.85) 113.46,30.66 LED21.2
$1N18241: length 1.9
  Top Layer w0.61: v1(113.65,24.44) 113.46,24.63 LED22.2
$1N20700: length 8.3
  Bottom Layer w0.61: XP12.1 2.3,3.21 0.87,4.64 0.87,7.37 1.57,8.07 R68.1 R67.1
$1N20704: length 1.9
  Bottom Layer w0.61: D7.1 2.4,11.69 R67.2
$1N20961: length 14
  Top Layer w0.61: XP13.1 2.09,87.94 2.09,86.62 1.18,85.71 1.18,82.97 2.7,81.44 v1(7.27,81.44)
  Bottom Layer w0.61: R70.1 v1(7.27,81.44) R69.1
$1N20964: length 1.7
  Bottom Layer w0.61: D8.1 6.33,78.61 R69.2
$1N28690: length 13.7
  Bottom Layer w0.305: SW2.2 62.75,50.96 68.23,45.48 68.23,43.65 67.64,43.05 U14.2
$1N28836: length 16.4
  Bottom Layer w0.61: LDR1.2 63.35,36.33 61.07,38.62 61.07,48.52 R72.2
$1N31594: length 6.7
  Bottom Layer w0.61: C46.1 5.8,83.51 Q9.1 4.83,85.45 XP13.2
$1N31601: length 13.4
  Top Layer w0.61: Q9.2 3.26,85.05 4.53,86.32 6.36,86.32 7.37,87.33 7.37,88.15
  Bottom Layer w0.61: Q9.2 3.26,83.63 2.58,82.95 C46.2 2.58,78.76 D8.2
$1N31638: length 6.8
  Bottom Layer w0.61: XP12.2 4.83,4.89 Q8.1 4.72,7.31 C45.1
$1N31645: length 11.1
  Bottom Layer w0.61: D7.2 6.78,12.19 C45.2 6.78,6.83 Q8.2 7.37,4.89 7.37,2.8

## Copper pours and planes (outline as drawn; the poured copper is in the pictures)
GND on Top Layer: -9.79,99.73 149.31,99.73 149.31,-8.17 -9.79,-8.17
GND on Top Layer: -0.35,90.89 131.02,90.89 131.02,0.06 -0.35,0.06
GND on Bottom Layer: -0.35,90.89 130.11,90.89 130.11,0.06 -0.35,0.06
GND on Bottom Layer: -0.35,22.31 27.05,0.06 130.72,0.06 130.72,90.59 27.24,90.89 -0.04,68.03

## Text on the board
Top Silkscreen Layer: <20% | >90% | 40% | 70% | +5 | Out | G | LIGHT / D37 | LIGHT / D36 | GND | 5v | A2 | SDA | SCL | BAT | Temp | Light | Rx | Tx | Top board v. 0.2 | (Rx)0 | A5 | (Tx)1 | A4 | A3 | 2 | ~3 | A1 | 4 | ~5 | A0 | ~6 | 7 | 8 | CND | ~9 | ~10 | 3.3v | ~11 | RESET | 12 | 13 | Aref | UART2 | ANALOG IN | DIGITAL (~ PWM) | COMPATABLE | VERGILIUM el. | vergilium2@gmail.com | QUANTUM MEGA | ARDUINO | UNO
